# EAGLE design iSENSE Data Logger (EAGLE 6.3)
DATE: 2012.09.24; DRAWN: C. Granz; DRGNO: 1; ORGANIZATION: Engaging Computing Group; REV: AA; TITLE: iSENSE Data Logger
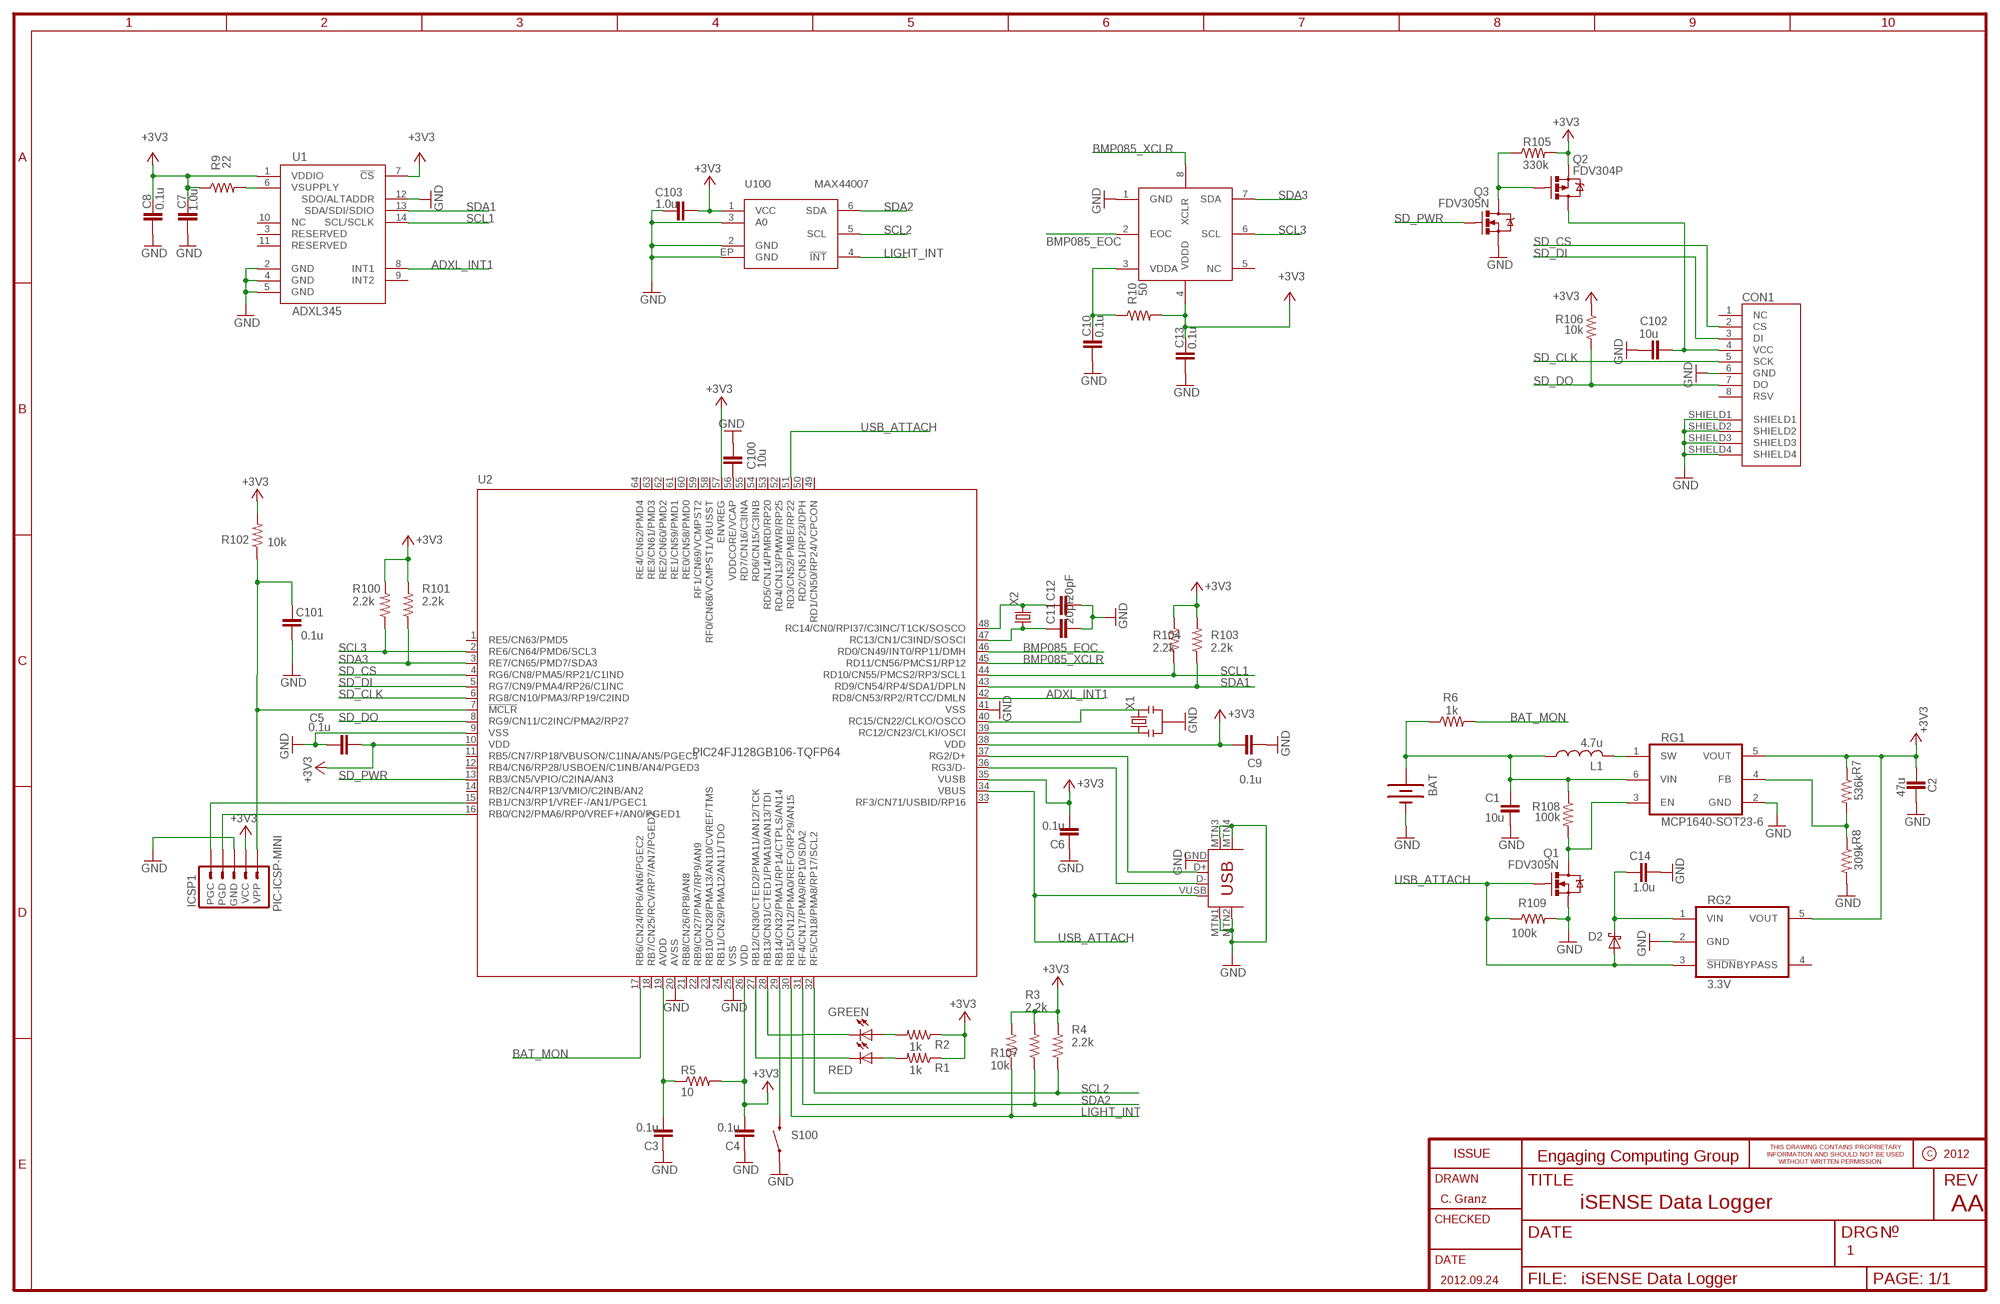
[diagram p0: schematic, sheet 1]

## Parts
BAT  BATTERY-AAA-PCB-1-NO-HOLES  [BATTERY_HOLDER_AAA_KEYSTONE_2466_NO_HOLES]
C1  10u  CAPACITOR-0603  [RCL_0603]
C2  47u  CAPACITOR-0603  [RCL_0603]
C3  0.1u  CAPACITOR-0402  [RCL_0402]
C4  0.1u  CAPACITOR-0402  [RCL_0402]
C5  0.1u  CAPACITOR-0402  [RCL_0402]
C6  0.1u  CAPACITOR-0402  [RCL_0402]
C7  1.0u  CAPACITOR-0402  [RCL_0402]
C8  0.1u  CAPACITOR-0402  [RCL_0402]
C9  0.1u  CAPACITOR-0402  [RCL_0402]
C10  0.1u  CAPACITOR-0402  [RCL_0402]
C11  20pF  CAPACITOR-0402  [RCL_0402]
C12  20pF  CAPACITOR-0402  [RCL_0402]
C13  0.1u  CAPACITOR-0402  [RCL_0402]
C14  1.0u  CAPACITOR-0603  [RCL_0603]
C100  10u  CAPACITOR-0603  [RCL_0603]
C101  0.1u  CAPACITOR-0402  [RCL_0402]
C102  10u  CAPACITOR-0402  [RCL_0402]
C103  1.0u  CAPACITOR-0402  [RCL_0402]
CON1  SOCKET_SD_CARD_MICRO-AMP-101-00303-68  [SOCKET_SD_CARD_MICRO]
D2  DIODE_SCHOTTKY-SOD523  [SOD523]
GREEN  GREEN  LED-0603  [LED_0603]
ICSP1  PIC-ICSP-MINI  [PIC-ICSP-MINI]
L1  4.7u  INDUCTOR-3X3MM  [INDUCTOR_3MM_X_3MM]
Q1  FDV305N  [SOT23-3]
Q2  FDV304P  FDV302P  [SOT23-3]
Q3  FDV305N  [SOT23-3]
R1  1k  RESISTOR-0402  [RCL_0402]
R2  1k  RESISTOR-0402  [RCL_0402]
R3  2.2k  RESISTOR-0402  [RCL_0402]
R4  2.2k  RESISTOR-0402  [RCL_0402]
R5  10  RESISTOR-0402  [RCL_0402]
R6  1k  RESISTOR-0402  [RCL_0402]
R7  536k  RESISTOR-0402  [RCL_0402]
R8  309k  RESISTOR-0402  [RCL_0402]
R9  22  RESISTOR-0402  [RCL_0402]
R10  50  RESISTOR-0402  [RCL_0402]
R100  2.2k  RESISTOR-0402  [RCL_0402]
R101  2.2k  RESISTOR-0402  [RCL_0402]
R102  10k  RESISTOR-0402  [RCL_0402]
R103  2.2k  RESISTOR-0402  [RCL_0402]
R104  2.2k  RESISTOR-0402  [RCL_0402]
R105  330k  RESISTOR-0402  [RCL_0402]
R106  10k  RESISTOR-0402  [RCL_0402]
R107  10k  RESISTOR-0402  [RCL_0402]
R108  100k  RESISTOR-0402  [RCL_0402]
R109  100k  RESISTOR-0402  [RCL_0402]
RED  RED  LED-0603  [LED_0603]
RG1  MCP1640-SOT23-6  [SOT23-6]
RG2  3.3V  TC1015  [SOT23-5]
S100  SWITCH_MOMENTARY-SMD-RA  [SWITCH_TACTILE_SMD_RA]
U1  ADXL345  [LGA14]
U2  PIC24FJ128GB106-TQFP64  [TQFP64-10X10]
U3  BMP085  [BMP085]
U100  MAX44007  [UTDFN-OPTO]
USB100  CON_USB_4_PIN-A_MALE  [CON_USB_A_MALE_CNC_TECH_1001-010-01001]
X1  CERAMIC_RESONATOR_3_PIN-2MM_X_4.5MM  [CERAMIC_RESONATOR_MURATA_2X4.5]
X2  CRYSTAL_2_PIN-4.9MM_X_1.8MM  [CRYSTAL_ABRACON_ABS10]

## Nets
+3V3 [power]: C2.1 C4.2 C5.1 C6.2 C7.2 C8.2 C9.1 C13.2 C103.1 ICSP1.2(VCC) Q2.2(S) R1.1 R2.1 R3.2 R4.2 R5.2 R7.1 R9.1 R10.2 R100.2 R101.2 R102.2 R103.2 R104.2 R105.2 R106.1 R107.2 RG1.5(VOUT) RG2.5(VOUT) U1.1(VDDIO) U1.7(!CS!) U2.10(VDD) U2.26(VDD) U2.35(VUSB) U2.38(VDD) U2.57(ENVREG) U3.4(VDDD) U100.1(VCC)
ADXL_INT1: U1.8(INT1) U2.42(RD8/CN53/RP2/RTCC/DMLN)
BAT_MON: R6.2 U2.17(RB6/CN24/RP6/AN6/PGEC2)
BMP085_EOC: U2.46(RD0/CN49/INT0/RP11/DMH) U3.2(EOC)
BMP085_XCLR: U2.45(RD11/CN56/PMCS1/RP12) U3.8(XCLR)
GND [power]: BAT.- C1.2 C2.2 C3.1 C4.1 C5.2 C6.1 C7.1 C8.1 C9.2 C10.1 C11.2 C12.2 C13.1 C14.2 C100.2 C101.2 C102.1 C103.2 CON1.6(GND) CON1.SHIELD1 CON1.SHIELD2 CON1.SHIELD3 CON1.SHIELD4 ICSP1.3(GND) Q1.2(S) Q3.2(S) R8.2 R109.2 RG1.2(GND) RG2.2(GND) S100.1 U1.2(GND) U1.4(GND) U1.5(GND) U1.12(SDO/ALTADDR) U2.9(VSS) U2.20(AVSS) U2.25(VSS) U2.41(VSS) U3.1(GND) U100.2(GND) U100.3(A0) U100.EP(GND) USB100.GND USB100.MTN1 USB100.MTN2 USB100.MTN3 USB100.MTN4 X1.2
LIGHT_INT: R107.1 U2.30(RB15/CN12/PMA0/REFO/RP29/AN15) U100.4(!INT!)
N$1: Q1.3(D) R108.2 RG1.3(EN)
N$2: R9.2 U1.6(VSUPPLY)
N$3: C10.2 R10.1 U3.3(VDDA)
N$4: GREEN.A R2.2
N$5: U2.39(RC12/CN23/CLKI/OSCI) X1.1
N$6: R1.2 RED.A
N$7: C14.1 D2.C RG2.1(VIN)
N$10: BAT.+ C1.1 L1.1 R6.1 R108.1 RG1.6(VIN)
N$11: L1.2 RG1.1(SW)
N$13: R7.2 R8.1 RG1.4(FB)
N$14: GREEN.C U2.28(RB13/CN31/CTED1/PMA10/AN13/TDI)
N$15: RED.C U2.27(RB12/CN30/CTED2/PMA11/AN12/TCK)
N$16: C11.1 U2.47(RC13/CN1/C3IND/SOSCI) X2.1
N$18: C12.1 U2.48(RC14/CN0/RPI37/C3INC/T1CK/SOSCO) X2.2
N$20: S100.2 U2.29(RB14/CN32/PMA1/RP14/CTPLS/AN14)
N$21 [power]: C102.2 CON1.4(VCC) Q2.3(D)
N$22: Q2.1(G) Q3.3(D) R105.1
N$40: U2.40(RC15/CN22/CLKO/OSCO) X1.3
N$44: ICSP1.5(PGC) U2.15(RB1/CN3/RP1/VREF-/AN1/PGEC1)
N$46: C100.1 U2.56(VDDCORE/VCAP)
N$47: C3.2 R5.1 U2.19(AVDD)
N$51: C101.1 ICSP1.1(VPP) R102.1 U2.7(!MCLR)
N$52: ICSP1.4(PGD) U2.16(RB0/CN2/PMA6/RP0/VREF+/AN0/PGED1)
N$53: U2.37(RG2/D+) USB100.D+
N$54: U2.36(RG3/D-) USB100.D-
SCL1: R104.1 U1.14(SCL/SCLK) U2.44(RD10/CN55/PMCS2/RP3/SCL1)
SCL2: R4.1 U2.32(RF5/CN18/PMA8/RP17/SCL2) U100.5(SCL)
SCL3: R100.1 U2.2(RE6/CN64/PMD6/SCL3) U3.6(SCL)
SD_CLK: CON1.5(SCK) U2.6(RG8/CN10/PMA3/RP19/C2IND)
SD_CS: CON1.2(CS) U2.4(RG6/CN8/PMA5/RP21/C1IND)
SD_DI: CON1.3(DI) U2.5(RG7/CN9/PMA4/RP26/C1INC)
SD_DO: CON1.7(DO) R106.2 U2.8(RG9/CN11/C2INC/PMA2/RP27)
SD_PWR: Q3.1(G) U2.13(RB3/CN5/VPIO/C2INA/AN3)
SDA1: R103.1 U1.13(SDA/SDI/SDIO) U2.43(RD9/CN54/RP4/SDA1/DPLN)
SDA2: R3.1 U2.31(RF4/CN17/PMA9/RP10/SDA2) U100.6(SDA)
SDA3: R101.1 U2.3(RE7/CN65/PMD7/SDA3) U3.7(SDA)
USB_ATTACH: D2.A Q1.1(G) R109.1 RG2.3(!SHDN!) U2.34(VBUS) U2.51(RD3/CN52/PMBE/RP22) USB100.VUSB(VBUS)
Unconnected: CON1.1(NC) CON1.8(RSV) RG2.4(BYPASS) U1.3(RESERVED) U1.9(INT2) U1.10(NC) U1.11(RESERVED) U2.1(RE5/CN63/PMD5) U2.11(RB5/CN7/RP18/VBUSON/C1INA/AN5/PGEC3) U2.12(RB4/CN6/RP28/USBOEN/C1INB/AN4/PGED3) U2.14(RB2/CN4/RP13/VMIO/C2INB/AN2) U2.18(RB7/CN25/RCV/RP7/AN7/PGED2) U2.21(RB8/CN26/RP8/AN8) U2.22(RB9/CN27/PMA7/RP9/AN9) U2.23(RB10/CN28/PMA13/AN10/CVREF/TMS) U2.24(RB11/CN29/PMA12/AN11/TDO) U2.33(RF3/CN71/USBID/RP16) U2.49(RD1/CN50/RP24/VCPCON) U2.50(RD2/CN51/RP23/DPH) U2.52(RD4/CN13/PMWR/RP25) U2.53(RD5/CN14/PMRD/RP20) U2.54(RD6/CN15/C3INB) U2.55(RD7/CN16/C3INA) U2.58(RF0/CN68/VCMPST1/VBUSST) U2.59(RF1/CN69/VCMPST2) U2.60(RE0/CN58/PMD0) U2.61(RE1/CN59/PMD1) U2.62(RE2/CN60/PMD2) U2.63(RE3/CN61/PMD3) U2.64(RE4/CN62/PMD4) U3.5(NC)

## Library data of the parts
BAT = CGranz:BATTERY: Battery Various Batteries and Battery Holders.; PN: 2466
C1 C100 = CGranz:CAPACITOR: Capacitor Various capacitor sizes.; EAGLEUP: C0603; PN: C0603C106M9PACTU
C2 = CGranz:CAPACITOR: Capacitor Various capacitor sizes.; EAGLEUP: C0603
C3-C6 C8-C10 C13 C101 = CGranz:CAPACITOR: Capacitor Various capacitor sizes.; EAGLEUP: C0402; PN: C0402C104M8PACTU
C7 C103 = CGranz:CAPACITOR: Capacitor Various capacitor sizes.; EAGLEUP: C0402; PN: C0402C105K9PACTU
C11 C12 = CGranz:CAPACITOR: Capacitor Various capacitor sizes.; EAGLEUP: C0402; PN: CBR04C200J5GAC
C14 = CGranz:CAPACITOR: Capacitor Various capacitor sizes.; EAGLEUP: C0603; PN: C0603C105K8PACTU
C102 = CGranz:CAPACITOR: Capacitor Various capacitor sizes.; EAGLEUP: C0402
CON1 = ArcadianElectronics:SOCKET_SD_CARD_MICRO: Micro SD Card Socket Various manufacturers.; PN: 101-00303-68
D2 = CGranz:DIODE_SCHOTTKY: Schottky Diode Various schottky diode sizes.; PN: 1N4148X-TP
GREEN = CGranz:LED: Light Emiting Diode Various LED sizes.; PN: LTST-S270GKT
ICSP1 = SparkFun:PIC-ICSP-MINI: PIC-ICSP-Mini Miniature 5-pin connection for temporary programming of PICs. Use this device in your design to save space. Program the PIC with this adapter Spark Fun Electronics SKU : BOB-00194; PN: DNP
L1 = CGranz:INDUCTOR: Inductor Various inductor sizes.; PN: NRH3012T4R7MN
Q1 Q3 = ArcadianElectronics:FDV305N: Fairchild N-Channel MOSFET Small N-Channel MOSFET.; PN: FDV305N
Q2 = ArcadianElectronics:FDV302P: Fairchild P-Channel MOSFET Small P-Channel MOSFET.; PN: FDV304P
R1 R2 R6 = CGranz:RESISTOR: Resistor Various resistor sizes.; EAGLEUP: R0402; PN: ERJ-2GEJ102X
R3 R4 R100 R101 R103 R104 = CGranz:RESISTOR: Resistor Various resistor sizes.; EAGLEUP: R0402; PN: ERJ-2GEJ222X
R5 = CGranz:RESISTOR: Resistor Various resistor sizes.; EAGLEUP: R0402; PN: ERJ-2GEJ100X
R7 = CGranz:RESISTOR: Resistor Various resistor sizes.; EAGLEUP: R0402; PN: ERJ-2RKF5363X
R8 = CGranz:RESISTOR: Resistor Various resistor sizes.; EAGLEUP: R0402; PN: ERJ-2RKF3093X
R9 = CGranz:RESISTOR: Resistor Various resistor sizes.; EAGLEUP: R0402; PN: ERJ-2GEJ220X
R10 = CGranz:RESISTOR: Resistor Various resistor sizes.; EAGLEUP: R0402; PN: ERJ-2GEJ510X
R102 R106 R107 = CGranz:RESISTOR: Resistor Various resistor sizes.; EAGLEUP: R0402; PN: ERJ-2GEJ103X
R105 = CGranz:RESISTOR: Resistor Various resistor sizes.; EAGLEUP: R0402; PN: ERJ-2GEJ334X
R108 R109 = CGranz:RESISTOR: Resistor Various resistor sizes.; EAGLEUP: R0402; PN: ERJ-2GEJ104X
RED = CGranz:LED: Light Emiting Diode Various LED sizes.; PN: LTST-S270EKT
RG1 = ArcadianElectronics:MCP1640; PN: MCP1640T-I/CHY
RG2 = CGranz:TC1015: Microchip CMOS LDO; PN: TC1015-3.3VCT713
S100 = CGranz:SWITCH_MOMENTARY: Switch - Momentary Various switch sizes.; PN: TL3340AF160QG
U1 = CGranz:ADXL345: Analog Devices 3-Axis Accelerometer Measurement range is adjustable: +/- 2g, +/- 4g, +/- 8g, +/- 16g. Includes both I2C and SPI interfaces.; PN: ADXL345BCCZ-RL
U2 = CGranz:PIC24FJ128GB106: Microchip 16-bit PIC Microcontroller w/ USB OTG PIC 16-bit microcontroller with USB OTG in various packages.; PN: PIC24FJ128GB106-I/PT
U3 = CGranz:BMP085: Bosch Temperature/Pressure Sensor I2C interface.; PN: BMP085
U100 = CGranz:MAX44007: Maxim Light Sensor I2C interface.; PN: MAX44007EDT+T
USB100 = CGranz:CON_USB_4_PIN: 4-Pin USB Connector Various sizes.; PN: 1001-010-01001
X1 = CGranz:CERAMIC_RESONATOR_3_PIN: Ceramic Resonator w/ Internal Capacitors Various frequencies and sizes.; PN: CSTCR4M00G53Z-R0
X2 = CGranz:CRYSTAL_2_PIN: Crystal Various frequencies and sizes.; PN: ABS10-32.768KHZ-1-T

## Net classes
1 power: width 0.254 mm

## Board
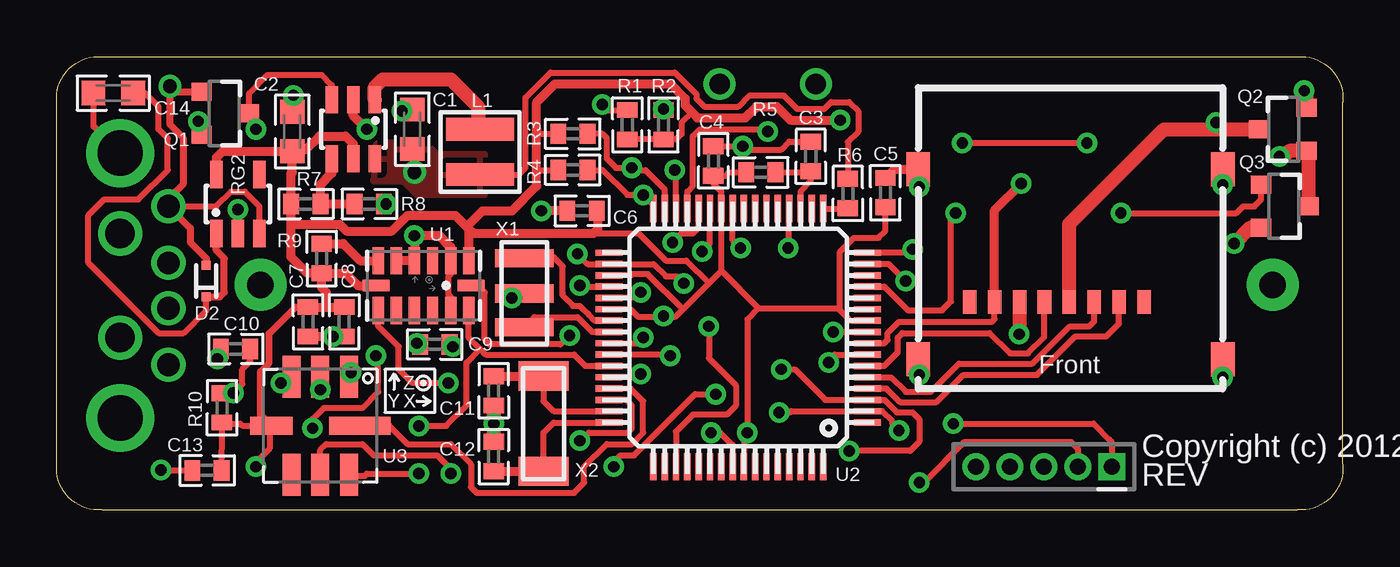
[diagram p1: board, top side]
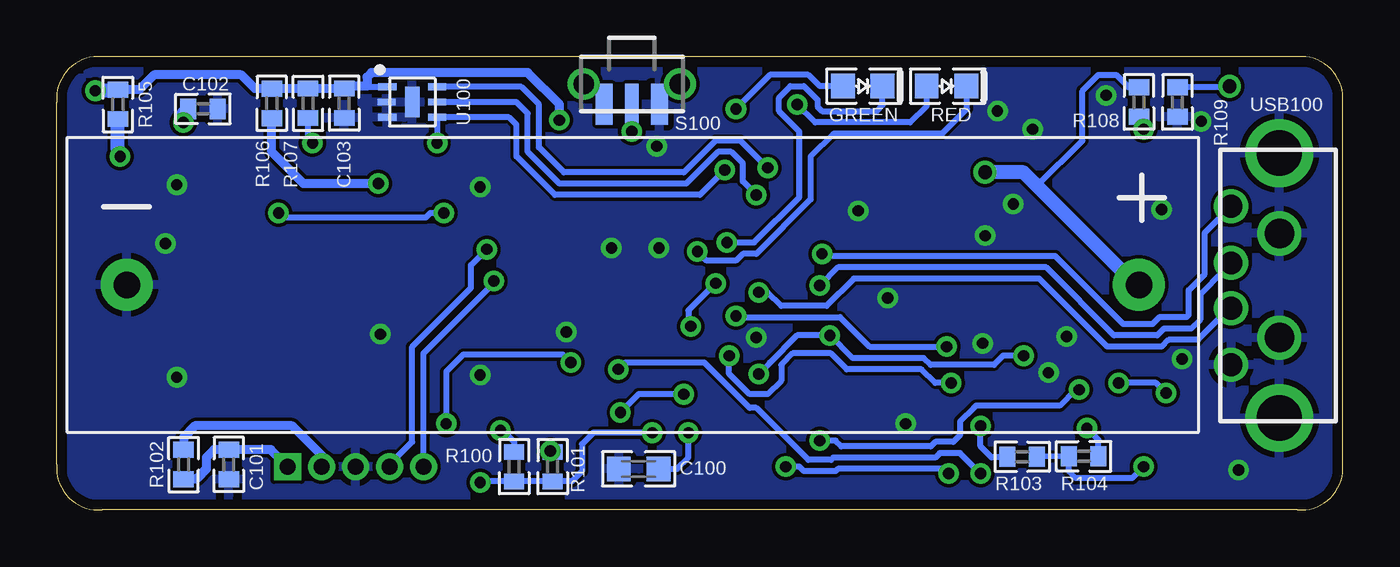
[diagram p2: board, bottom side, seen from below]

Size 56.81 x 20.01 mm. Coordinates in mm from the lower left corner, seen from the top.
Outline: 2.01,20.01 54.81,20.01 arc-100 56.81,18.01 56.81,2.01 arc-100 54.81,0.01 2.01,0.01 arc-100 0.01,2.01 0.01,18.01 arc-100 2.01,20.01
Copper layers (1*16): Top 0.035mm / dielectric 1.5mm / Bottom 0.035mm
Design rules "default *": minimum track width 10mil, minimum drill 24mil, track to track 6mil, track to pad 6mil, pad to pad 6mil, via to via 6mil, smd to smd 6mil, copper to edge 18mil, drill to drill 8mil, minimum pad ring 10mil, minimum via ring 8mil, stop-mask expansion 4mil, vias tented up to drill 0mil, thermal gap 10mil

### Footprints (pad centres in the part's own frame; a part is rotated, then mirrored left to right if it is on the bottom)
BATTERY_HOLDER_AAA_KEYSTONE_2466_NO_HOLES = drill 1.17 pad 2.3: + 47.346,6.502; - 2.642,6.502
RCL_0603 = smd 1.05 x 1.08: 1 -0.875,0; 2 0.875,0
RCL_0402 = smd 0.7 x 0.9: 1 -0.65,0; 2 0.65,0
SOCKET_SD_CARD_MICRO = smd 0.6 x 1.05: 1 9.97,-9.47; 2 8.87,-9.47; 3 7.77,-9.47; 4 6.67,-9.47; 5 5.57,-9.47; 6 4.47,-9.47; 7 3.37,-9.47; 8 2.27,-9.47 | smd 1.05 x 1.5: SHIELD1 0,-3.6; SHIELD2 13.45,-3.6; SHIELD3 0,-12; SHIELD4 13.45,-12
SOD523 = smd 0.4 x 0.4: A 0.7,0; C -0.7,0
LED_0603 = smd 1.05 x 1.08: A -0.875,0; C 0.875,0
PIC-ICSP-MINI = drill 0.7 square: 1 -3,0 | drill 0.7: 2 -1.5,0; 3 0,0; 4 1.5,0; 5 3,0
INDUCTOR_3MM_X_3MM = smd 3 x 1: 1 0,1; 2 0,-1
SOT23-3 = smd 0.8 x 0.9: 1 -0.95,-1; 2 0.95,-1; 3 0,1.1
SOT23-6 = smd 0.55 x 1.2: 1 -0.95,-1.3; 2 0,-1.3; 3 0.95,-1.3; 4 0.95,1.3; 5 0,1.3; 6 -0.95,1.3
SOT23-5 = smd 0.55 x 1.2: 1 -0.95,-1.3; 2 0,-1.3; 3 0.95,-1.3; 4 0.95,1.3; 5 -0.95,1.3
SWITCH_TACTILE_SMD_RA = smd 0.75 x 1.8: 1 -1.225,0.9; 3 1.225,0.9 | smd 0.6 x 1.8: 2 0,0.9 | drill 0.9 pad 1.4: CASE1 -2.125,0; CASE2 2.125,0
LGA14 = smd 0.5 x 1.2: 1 2,1.1; 2 1.2,1.1; 3 0.4,1.1; 4 -0.4,1.1; 5 -1.2,1.1; 6 -2,1.1; 8 -2,-1.1; 9 -1.2,-1.1; 10 -0.4,-1.1; 11 0.4,-1.1; 12 1.2,-1.1; 13 2,-1.1 | smd 1.2 x 0.5: 7 -2.1,0; 14 2.1,0
TQFP64-10X10 = smd 1.2 x 0.28: 1 -5.7,3.75; 2 -5.7,3.25; 3 -5.7,2.75; 4 -5.7,2.25; 5 -5.7,1.75; 6 -5.7,1.25; 7 -5.7,0.75; 8 -5.7,0.25; 9 -5.7,-0.25; 10 -5.7,-0.75; 11 -5.7,-1.25; 12 -5.7,-1.75; 13 -5.7,-2.25; 14 -5.7,-2.75; 15 -5.7,-3.25; 16 -5.7,-3.75; 33 5.7,-3.75; 34 5.7,-3.25; 35 5.7,-2.75; 36 5.7,-2.25; 37 5.7,-1.75; 38 5.7,-1.25; 39 5.7,-0.75; 40 5.7,-0.25; 41 5.7,0.25; 42 5.7,0.75; 43 5.7,1.25; 44 5.7,1.75; 45 5.7,2.25; 46 5.7,2.75; 47 5.7,3.25; 48 5.7,3.75 | smd 0.28 x 1.2: 17 -3.75,-5.7; 18 -3.25,-5.7; 19 -2.75,-5.7; 20 -2.25,-5.7; 21 -1.75,-5.7; 22 -1.25,-5.7; 23 -0.75,-5.7; 24 -0.25,-5.7; 25 0.25,-5.7; 26 0.75,-5.7; 27 1.25,-5.7; 28 1.75,-5.7; 29 2.25,-5.7; 30 2.75,-5.7; 31 3.25,-5.7; 32 3.75,-5.7; 49 3.75,5.7; 50 3.25,5.7; 51 2.75,5.7; 52 2.25,5.7; 53 1.75,5.7; 54 1.25,5.7; 55 0.75,5.7; 56 0.25,5.7; 57 -0.25,5.7; 58 -0.75,5.7; 59 -1.25,5.7; 60 -1.75,5.7; 61 -2.25,5.7; 62 -2.75,5.7; 63 -3.25,5.7; 64 -3.75,5.7
BMP085 = smd 1.87 x 0.8: 1 -2.165,1.27; 2 -2.165,0; 3 -2.165,-1.27; 5 2.165,-1.27; 6 2.165,0; 7 2.165,1.27 | smd 0.8 x 1.87: 4 0,-2.165 | smd 0.8 x 2.7: 8 0,1.75
UTDFN-OPTO = smd 0.3 x 0.8: 1 -0.675,-1.1; 2 0,-1.125; 3 0.675,-1.1; 4 0.675,1.1; 5 0,1.1; 6 -0.675,1.1 | smd 1.35 x 0.65: EP 0,0
CON_USB_A_MALE_CNC_TECH_1001-010-01001 = drill 1: D+ 2.13,1; D- 2.13,-1; GND 2.13,3.5; VUSB 2.13,-3.5 | drill 2: MTN1 0,-5.85; MTN4 0,5.85 | drill 1.3: MTN2 0,-2.3; MTN3 0,2.3
CERAMIC_RESONATOR_MURATA_2X4.5 = smd 0.8 x 2.6: 1 0.7,1; 2 2.25,1; 3 3.75,1
CRYSTAL_ABRACON_ABS10 = smd 1.3 x 2.2: 1 -2.1,0; 2 2.1,0

### Placement (x,y rotation side)
BAT  56.36,3.44 0 bottom
C1  15.71,16.81 90 top
C2  10.41,16.71 90 top
C3  33.31,15.61 270 top
C4  29.01,15.41 270 top
C5  36.61,14.01 90 top
C6  23.21,13.21 0 top
C7  11.11,8.31 90 top
C8  12.71,8.31 90 top
C9  16.71,7.31 180 top
C10  7.91,7.11 0 top
C11  19.31,5.26 270 top
C12  19.31,2.36 90 top
C13  6.65,1.75 0 top
C14  2.51,18.41 180 top
C100  31.11,1.81 180 bottom
C101  49.21,2.01 270 bottom
C102  50.35,17.71 180 bottom
C103  44.11,17.96 270 bottom
CON1  38.06,18.65 0 top
D2  6.61,10.11 90 top
GREEN  21.21,18.71 0 bottom
ICSP1  43.61,1.91 180 top
L1  18.71,15.81 180 top
Q1  7.41,17.51 270 top
Q2  54.21,16.81 90 top
Q3  54.21,13.41 270 top
R1  25.21,17.01 90 top
R2  26.81,17.01 90 top
R3  22.81,16.61 180 top
R4  22.81,15.01 180 top
R5  31.11,14.91 180 top
R6  34.95,13.97 270 top
R7  11.01,13.51 0 top
R8  13.81,13.51 0 top
R9  11.71,11.11 90 top
R10  7.31,4.51 270 top
R100  36.61,1.91 270 bottom
R101  34.91,1.91 270 bottom
R102  51.21,2.01 90 bottom
R103  14.17,2.35 0 bottom
R104  11.45,2.37 180 bottom
R105  54.11,17.91 90 bottom
R106  47.31,17.95 270 bottom
R107  45.71,17.96 90 bottom
R108  9.01,18.01 270 bottom
R109  7.31,18.01 270 bottom
RED  17.51,18.71 0 bottom
RG1  13.11,16.81 180 top
RG2  8.01,13.51 0 top
S100  31.41,18.81 180 bottom
U1  16.21,9.91 0 top
U2  30.11,7.61 180 top
U3  11.65,3.72 270 top
U100  41.11,18.01 270 bottom
U$100  [INFO_BOARD1]  47.93,1.07 0 top
USB100  2.81,9.91 180 bottom
X1  19.66,11.81 270 top
X2  21.51,3.81 270 top

### Tracks (layer width: path | path; a pad name or v marks a point on that pad's centre or on a via)
+3V3  (via drill 0.5)
  Top 0.254: C13.2 7.3,2.32 7.31,3.01 R10.2 7.36,3.81 8.11,3.81 8.2,3.72 U3.4 9.41,3.59 9.41,2.71 8.81,2.11 v8.81,1.91 | U2.57 30.36,3.26 v30.51,3.41 30.51,8.41 31.01,8.91 | 34.61,8.81 35.06,8.36 U2.10 | 34.61,8.81 34.61,11.41 35.21,12.01 36.31,12.01 36.61,12.31 C5.1 | 34.61,8.81 34.51,8.91 31.01,8.91 | 10.46,12.61 10.36,12.61 10.36,12.51 | C9.1 17.41,7.11 v17.51,7.21 | v38.11,1.21 38.31,1.21 40.11,3.01 44.81,3.01 45.11,2.71 ICSP1.2 | 23.71,12.21 25.71,12.21 26.91,11.01 27.81,11.01 28.81,10.01 | U2.35 25.36,10.36 25.41,10.41 26.11,10.41 27.66,8.86 | 30.41,15.06 R5.2 29.71,14.91 29.56,14.76 C4.2 29.01,14.41 29.36,14.06 U2.26 29.36,10.56 | R1.1 R2.1 27.36,16.36 27.61,16.61 27.61,17.11 28.06,17.56 | R4.2 21.31,15.01 21.21,14.91 | R3.2 21.31,16.61 21.21,16.81 | 28.81,10.01 29.36,10.56 | U2.38 25.36,8.86 25.71,8.51 26.76,8.51 | 26.76,8.51 v26.81,8.56 | 26.76,8.51 27.31,8.51 27.66,8.86 | 28.81,10.01 27.66,8.86 | 29.36,10.56 31.01,8.91
  Top 0.305: C7.2 10.56,8.96 9.38,7.78 9.38,6.48 9.01,6.11 9.01,4.19 U3.4 | 7.06,15.41 6.96,15.31
  Top 0.406: C2.1 10.41,14.91 10.36,14.86 R7.1 10.36,12.51 10.36,11.16 11.06,10.46 R9.1 | RG1.5 13.11,16.16 12.76,16.51 11.61,16.51 11.01,15.91 10.48,15.91 C2.1 | C7.2 11.91,8.96 | 11.91,8.96 C8.2 | R9.1 11.71,9.81 11.91,9.61 11.91,8.96 | U1.7 13.31,9.91 12.76,10.46 R9.1 | 10.46,12.61 12.51,12.61 12.81,12.31 14.81,12.31 15.51,13.01 17.61,13.01 18.11,12.51 | 18.21,12.41 U1.1 | 18.11,12.51 18.21,12.41 | C6.2 23.91,13.06 23.91,12.41 23.71,12.21 18.41,12.21 18.21,12.41 | v34.61,17.21 32.41,17.21 31.81,17.81 30.91,17.81 30.41,17.31 28.31,17.31 28.06,17.56 27.76,17.86 27.76,18.16 27.11,18.81 22.01,18.81 21.21,18.01 21.21,16.81 21.21,14.91 21.21,14.31 20.11,13.21 18.81,13.21 18.11,12.51 | RG2.5 7.06,15.41 7.06,15.56 7.31,15.81 10.38,15.81 C2.1
  Top 0.61: Q2.2 55.21,18.61 v55.11,18.51
  Bottom 0.254: v30.51,3.41 33.11,3.41 33.61,2.91 33.61,1.71 34.06,1.26 R101.2 R100.2 38.06,1.26 v38.11,1.21 | v26.81,8.56 26.76,8.51 22.21,8.51 20.91,7.21 v17.51,7.21 | R103.2 R104.2 12.1,1.7 11.81,1.41 9.31,1.41 v8.81,1.91 | C103.1 44.03,18.68 | U100.1 43.08,18.68 43.11,18.71
  Bottom 0.305: v8.81,1.91 v8.82,1.92
  Bottom 0.406: ICSP1.2 45.11,2.41 46.41,3.71 50.71,3.71 51.21,3.21 R102.2 | R105.2 53.16,18.56 52.51,19.21 48.66,19.21 48.05,18.6 R106.1 45.61,18.6 | v34.61,17.21 34.61,17.91 36.01,19.31 42.91,19.31 43.11,19.11 43.11,18.71 44.01,18.71 C103.1 45.61,18.6 | R107.2 45.61,18.61 45.61,18.6
  Bottom 0.61: v55.11,18.51 54.26,18.51 R105.2
ADXL_INT1  (via drill 0.5)
  Top 0.254: U2.42 27.06,6.86 v27.11,6.81 | U1.8 14.21,8.11 15.11,7.21 15.11,6.21 15.71,5.61 v17.31,5.61
  Bottom 0.254: v27.11,6.81 27.11,6.01 26.21,5.11 25.41,5.11 24.81,5.71 24.81,6.41 24.31,6.91 22.61,6.91 21.91,6.21 18.61,6.21 18.01,5.61 v17.31,5.61
BAT_MON
  Top 0.254: U2.17 R6.2
BMP085_EOC  (via drill 0.5)
  Top 0.254: U2.46 25.16,4.86 25.41,4.61 25.41,3.61 25.21,3.41 23.51,3.41 23.46,3.36 23.21,3.16 v23.11,3.06
  Top 0.406: v11.66,5.31 11.66,5.87 U3.2
  Bottom 0.254: v23.11,3.06 22.41,3.06 22.16,2.81 18.21,2.81 18.01,3.01 17.21,3.01 16.91,3.31 16.91,3.91 16.31,4.51 16.21,4.61 12.51,4.61 11.81,5.31 v11.66,5.31
BMP085_XCLR
  Top 0.254: U2.45 25.36,5.36 25.91,4.81 25.91,3.41 25.41,2.91 24.31,2.91 23.31,1.91 23.31,1.21 22.86,0.76 18.56,0.76 18.31,1.01 18.31,2.01 17.41,2.91 15.51,2.91 14.7,3.72 U3.8
GND  (via drill 0.5)
  Top 0.254: v20.11,9.36 X1.2 | U2.41 25.71,7.36 v25.91,7.61 | C13.1 5.62,1.75 v4.61,1.76 | C10.1 7.26,6.81 v7.11,6.66 | v34.31,7.86 U2.9 | U1.2 17.41,10.41 17.31,10.31 17.31,9.51 17.41,9.41 U1.12 | U2.20 32.36,11.61 v32.31,11.56 | U2.25 29.86,11.91 v30.21,11.56 | C3.1 32.36,16.26 32.01,15.91 30.56,15.91 30.46,15.91 v30.31,16.06 C4.1 | C14.2 1.63,16.93 USB100.MTN1
  Top 0.305: U3.1 13.03,5.88 v13.01,6.06 | C9.2 v15.91,7.36 | Q1.2 6.41,17.01 v6.26,17.16
  Top 0.406: RG1.2 13.11,17.41 v13.71,16.81 | C1.2 v15.26,17.61 | R8.2 14.41,13.56 v14.56,13.51 | CON1.SHIELD4 51.52,6.45 v51.51,5.86 | C2.2 10.41,17.86 v10.46,18.31 | v38.11,14.26 38.1,14.95 CON1.SHIELD1 37,15.05 C5.2 | CON1.SHIELD3 38,6.35 v38.11,5.96 | C7.1 v12.21,7.66 C8.1 | U1.5 U1.4 v15.81,12.11 16.91,12.11 17.41,11.61 U1.2 | C6.1 v21.41,13.21 | RG2.2 v8.01,13.26
  Top 0.61: CON1.6 42.53,7.78 v42.51,7.76 | Q3.2 52.71,12.46 v52.01,11.76 | CON1.SHIELD2 v51.51,14.36 | C12.2 v19.31,3.81 C11.2
  pour Bottom: 0.11,20.01 56.81,20.01 56.81,0.01 0.11,0.01 0.11,19.91
LIGHT_INT  (via drill 0.5)
  Top 0.254: U2.30 27.36,14.96 v27.31,15.01 | v40.01,16.21 v45.51,16.21
  Bottom 0.254: v27.31,15.01 28.41,13.91 34.81,13.91 36.51,15.61 36.51,17.01 36.83,17.33 U100.4 v40.01,16.21 | v45.51,16.21 45.71,16.41 R107.1
N$1  (via drill 0.5)
  Top 0.254: v8.81,16.81 8.81,16.91 8.51,17.21 Q1.3 8.51,18.41 9.31,19.21 11.71,19.21 12.16,18.76 RG1.3
  Bottom 0.254: R108.2 9.01,17.01 v8.81,16.81
N$2
  Top 0.406: U1.6 13.41,11.01 12.71,11.71 12.66,11.76 R9.2
N$3  (via drill 0.5)
  Top 0.254: R10.1 v7.81,5.16 8.21,5.56 8.21,6.21 8.56,6.56 C10.2
  Top 0.305: U3.3 10.38,5.54 v9.91,5.61 | R10.1 v7.81,5.16
  Bottom 0.254: v9.91,5.61 8.26,5.61 8.18,5.53 v7.81,5.16
N$4  (via drill 0.5)
  Top 0.254: R2.2 26.86,17.66 v26.81,17.71
  Bottom 0.254: GREEN.A 23.11,18.71 23.61,19.21 25.31,19.21 v26.81,17.71
N$5
  Top 0.254: 22.36,9.46 22.36,9.56 | 22.36,9.46 22.36,9.56 | 22.36,9.56 22.36,10.76 21.96,11.16 X1.1 | 22.36,9.46 22.36,9.56 | U2.39 23.76,8.36 23.51,8.61 23.31,8.81 23.11,9.01 22.81,9.01 22.36,9.46
N$6  (via drill 0.5)
  Top 0.254: R1.2 24.36,17.66 v24.11,17.91
  Bottom 0.254: RED.A 18.38,17.83 19.11,17.11 23.31,17.11 v24.11,17.91
N$7
  Top 0.254: D2.C 6.61,8.81 5.61,7.81 4.51,7.81 1.41,10.91 1.41,13.01 2.11,13.71 3.61,13.71 4.91,15.01 4.91,16.41 4.51,16.81 4.51,17.81 3.91,18.41 C14.1
  Top 0.305: D2.C 7.21,9.41 7.41,9.61 7.41,11.11 7.06,11.46 RG2.1
N$10  (via drill 0.6)
  Top 0.254: v15.81,14.91 15.81,15.83 C1.1 | R6.1 34.95,16.25 35.41,16.71 35.41,17.61 35.01,18.01 34.21,18.01 33.91,17.71 32.71,17.71 32.11,18.31 30.61,18.31 30.11,17.81 28.61,17.81 28.26,18.16 28.26,18.36 27.31,19.31 21.81,19.31 20.71,18.21 20.71,15.11 20.41,14.81 L1.1
  Bottom 0.254: R108.1 9.46,18.66 10.01,19.21 10.81,19.21 11.51,18.51 11.51,16.31 13.51,14.31
  Bottom 0.61: BAT.+ 9.14,9.94 13.51,14.31 14.11,14.91 v15.81,14.91
  pour Top: 14.01,14.51 15.31,14.51 15.91,13.91 18.91,13.91 19.21,14.21 19.21,15.41 18.91,15.71 16.81,15.71 16.31,16.21 14.21,16.21 13.91,15.91 13.91,14.61
N$11
  Top 0.61: RG1.1 14.06,18.66 14.41,19.01 17.41,19.01 18.61,17.81 18.61,16.91 L1.2
N$13
  Top 0.406: RG1.4 12.16,14.86 11.66,14.36 R7.2 R8.1
N$14  (via drill 0.5)
  Top 0.254: U2.28 28.36,12.46 28.11,12.21 27.61,12.21 v27.21,11.81
  Bottom 0.254: v27.21,11.81 26.01,11.81 24.01,13.81 24.01,16.71 24.91,17.61 24.91,18.21 24.41,18.71 23.81,18.71 23.21,18.11 23.21,17.81 23.01,17.61 20.61,17.61 20.33,17.88 GREEN.C
N$15  (via drill 0.5)
  Top 0.254: U2.27 28.86,11.76 v28.51,11.41
  Bottom 0.254: v28.51,11.41 28.11,11.01 26.81,11.01 26.51,11.31 25.91,11.31 23.51,13.71 23.51,15.61 22.51,16.61 17.71,16.61 16.61,17.71 16.61,18.68 RED.C
N$16
  Top 0.254: U2.47 21.96,4.36 21.51,4.81 X2.1
  Top 0.406: C11.1 X2.1
N$18
  Top 0.254: U2.48 21.96,3.86 21.51,3.41 X2.2
  Top 0.406: C12.1 X2.2
N$20  (via drill 0.5)
  Top 0.254: U2.29 27.86,14.06 28.11,14.31 28.11,16.51 28.41,16.81 31.31,16.81 v31.41,16.71
  Bottom 0.254: v31.41,16.71 31.41,16.61 v31.41,16.71 | v31.41,16.71 S100.2
N$21  (via drill 0.5)
  Top 0.61: 51.31,16.81 48.91,16.81 45.01,12.91 44.73,12.63 CON1.4 | 51.31,16.81 52.31,16.81 | 52.31,16.81 Q2.3 | 51.31,16.81 v51.21,17.11 | 51.31,16.81 52.31,16.81
  Bottom 0.61: C102.2 51.2,17.52 v51.21,17.11
N$22  (via drill 0.5)
  Top 0.61: Q3.3 55.31,15.76 Q2.1 54.46,15.86 54.41,15.81 54.21,15.61 v54.01,15.61
  Bottom 0.61: R105.1 54.11,15.91 v54.01,15.61
N$40
  Top 0.254: U2.40 23.66,7.86 23.01,8.51 21.11,8.51 X1.3
N$44  (via drill 0.5)
  Top 0.254: U2.15 36.76,10.86 v37.51,10.11
  Bottom 0.254: v37.51,10.11 37.51,10.01 40.61,6.91 ICSP1.5
N$46  (via drill 0.5)
  Top 0.254: v28.91,3.41 29.31,3.41 29.81,2.91 29.86,2.86 U2.56
  Bottom 0.254: C100.1 29.41,1.81 28.91,2.31 v28.91,3.41
N$47
  Top 0.254: U2.19 32.86,14.06 33.31,14.51 C3.2 33.36,14.91 32.61,14.91 32.51,14.91 R5.1 31.86,15.01
N$51  (via drill 0.5)
  Top 0.254: U2.7 34.36,6.86 v34.11,6.51 | v39.61,3.81 45.81,3.81 46.51,3.11 46.61,3.01 ICSP1.1
  Bottom 0.254: v34.11,6.51 34.46,6.86 U2.7 38.86,6.86 39.61,6.11 v39.61,3.81
  Bottom 0.406: ICSP1.1 47.36,2.66 C101.1 49.86,2.66 50.21,2.31 50.21,1.81 50.61,1.41 50.66,1.36 R102.1
N$52  (via drill 0.5)
  Top 0.254: U2.16 37.56,11.36 v37.81,11.51
  Bottom 0.254: ICSP1.4 42.11,2.01 41.11,3.01 41.11,7.21 38.51,9.81 38.51,10.81 v37.81,11.51
N$53  (via drill 0.5)
  Top 0.254: U2.37 25.56,9.36 v25.81,9.61
  Bottom 0.254: USB100.D+ 5.01,8.91 6.41,7.51 7.71,7.51 8.01,7.21 10.41,7.21 13.41,10.21 21.61,10.21 22.81,9.01 24.81,9.01 25.41,9.61 v25.81,9.61
N$54  (via drill 0.5)
  Top 0.254: U2.36 23.16,9.86 v23.11,9.91
  Bottom 0.254: USB100.D- 5.31,10.51 6.31,9.51 6.31,8.41 6.71,8.01 7.91,8.01 8.21,7.71 10.11,7.71 13.11,10.71 22.31,10.71 v23.11,9.91
SCL1  (via drill 0.5)
  Top 0.254: U1.14 18.61,9.91 18.91,9.61 18.91,7.51 19.11,7.31 22.26,7.31 v22.66,7.71 | v25.81,6.01 25.71,5.91 25.66,5.86 U2.44 | v11.31,3.61 11.31,4.01 11.81,4.51 13.51,4.51 14.21,5.21 14.21,6.71 v14.11,6.81
  Bottom 0.254: v25.81,6.01 25.31,6.51 24.11,7.71 v22.66,7.71 21.66,6.71 18.51,6.71 18.21,6.41 15.41,6.41 15.01,6.81 v14.11,6.81 | R104.1 10.8,3.1 v11.31,3.61
SCL2  (via drill 0.5)
  Top 0.254: U2.32 26.36,13.46 v25.91,13.91 25.21,13.91 24.11,15.01 R4.1
  Bottom 0.254: U100.5 36.51,18.01 36.01,17.51 36.01,15.81 34.61,14.41 29.01,14.41 27.61,15.81 27.01,15.81 26.51,15.31 26.51,14.51 v25.91,13.91
SCL3  (via drill 0.5)
  Top 0.254: U3.6 11.65,2.65 11.91,2.91 13.51,2.91 14.01,2.41 16.81,2.41 17.21,2.01 17.21,1.81 v17.41,1.61 | v31.91,4.31 32.41,4.31 32.46,4.36 U2.2 36.46,4.36 36.91,3.91 36.91,3.81 v37.21,3.51 | v24.61,1.91 24.61,2.11 24.91,2.41 25.51,2.41 28.21,5.11 v29.11,5.11
  Bottom 0.254: v37.21,3.51 37.11,3.51 36.61,3.01 R100.1 | 17.51,1.61 v17.41,1.61 17.61,1.81 22.31,1.81 22.41,1.71 23.81,1.71 24.01,1.91 v24.61,1.91 | v29.11,5.11 31.11,5.11 v31.91,4.31
SD_CLK
  Top 0.254: U2.6 36.56,6.36 37.16,6.96 37.16,7.61 37.36,7.81 41.21,7.81 42.11,6.91 42.91,6.91 43.63,7.63 CON1.5
SD_CS
  Top 0.254: U2.4 36.66,5.36 37.26,4.76 38.86,4.76 40.06,5.96 43.31,5.96 45.01,7.66 46.36,7.66 46.91,8.21 46.93,8.23 CON1.2
SD_DI
  Top 0.254: U2.5 36.86,5.86 37.51,5.21 38.61,5.21 39.86,6.46 43.11,6.46 44.76,8.11 45.61,8.11 45.81,8.31 45.83,8.33 CON1.3
SD_DO  (via drill 0.5)
  Top 0.254: U2.8 36.56,7.36 36.71,7.51 36.71,7.81 37.21,8.31 41.31,8.31 41.43,8.43 CON1.7
  Top 0.406: CON1.7 41.43,13.23 v42.61,14.41
  Bottom 0.406: v42.61,14.41 45.91,14.41 47.31,15.81 R106.2
SD_PWR  (via drill 0.5)
  Top 0.254: U2.13 36.56,9.86 37.61,8.81 39.11,8.81 39.51,9.21 39.51,12.91 v39.71,13.11 | v47.01,13.11 52.11,13.11 52.41,13.41 52.91,13.41 53.21,13.71 Q3.1
  Bottom 0.254: v39.71,13.11 40.31,13.11 40.51,12.91 46.81,12.91 v47.01,13.11
SDA1  (via drill 0.5)
  Top 0.254: U1.13 18.21,7.61 18.71,7.11 | 18.71,7.11 18.96,6.86 22.86,6.86 23.31,6.41 23.36,6.36 U2.43 | v16.01,3.71 17.21,3.71 18.11,4.61 18.11,6.51 18.71,7.11
  Bottom 0.254: R103.1 14.82,2.32 15.52,2.32 16.01,2.81 v16.01,3.71
SDA2  (via drill 0.5)
  Top 0.254: U2.31 26.86,14.16 26.01,15.01 25.61,15.01 v25.41,15.11 24.71,15.11 24.31,15.51 24.31,16.41 24.11,16.61 R3.1
  Bottom 0.254: U100.6 36.28,18.68 35.51,17.91 35.51,16.01 34.41,14.91 29.11,14.91 27.71,16.31 26.61,16.31 v25.41,15.11
SDA3  (via drill 0.5)
  Top 0.254: v32.01,6.21 32.61,6.21 33.96,4.86 U2.3 36.56,4.86 37.11,4.31 37.81,4.31 38.11,4.01 38.11,3.01 37.71,2.61 v35.01,2.61 | U3.7 12.96,1.51 13.61,1.51 13.71,1.61 v16.01,1.61
  Bottom 0.254: R101.1 34.96,2.56 v35.01,2.61 | v16.01,1.61 16.91,2.51 17.81,2.51 18.01,2.31 22.51,2.31 22.61,2.21 23.61,2.21 25.91,4.51 26.21,4.51 28.21,6.51 31.71,6.51 v32.01,6.21
USB_ATTACH  (via drill 0.5, 0.6)
  Top 0.254: RG2.3 8.96,13.41 8.31,14.06 7.71,14.06 7.06,13.41 USB100.VUSB | v23.01,11.31 23.46,10.86 U2.34 26.36,10.86 26.91,10.31 27.41,10.31 v27.71,10.01 | v28.81,8.11 28.81,6.71 30.01,5.51 30.01,4.61 29.61,4.21 28.11,4.21 27.36,3.46 U2.51
  Top 0.305: Q1.1 5.26,18.46 v5.01,18.71 5.01,17.01 5.61,16.41 5.61,14.41 4.94,13.74 USB100.VUSB 5.91,12.44 5.91,11.81 6.61,11.11 D2.A
  Top 0.406: v5.01,18.71 4.81,18.51
  Bottom 0.254: R109.1 5.06,18.66 v5.01,18.71 | v23.01,11.31 22.81,11.31 22.71,11.21 12.71,11.21 9.71,8.21 8.41,8.21 8.11,8.51 6.91,8.51 6.81,8.61 6.81,9.71 6.11,10.41 6.11,12.24 USB100.VUSB | v27.71,10.01 28.91,8.81 28.91,8.21 v28.81,8.11

### Text on the board
tNames: Z | Y | X